# EAGLE design Interface (EAGLE 7.6.0)
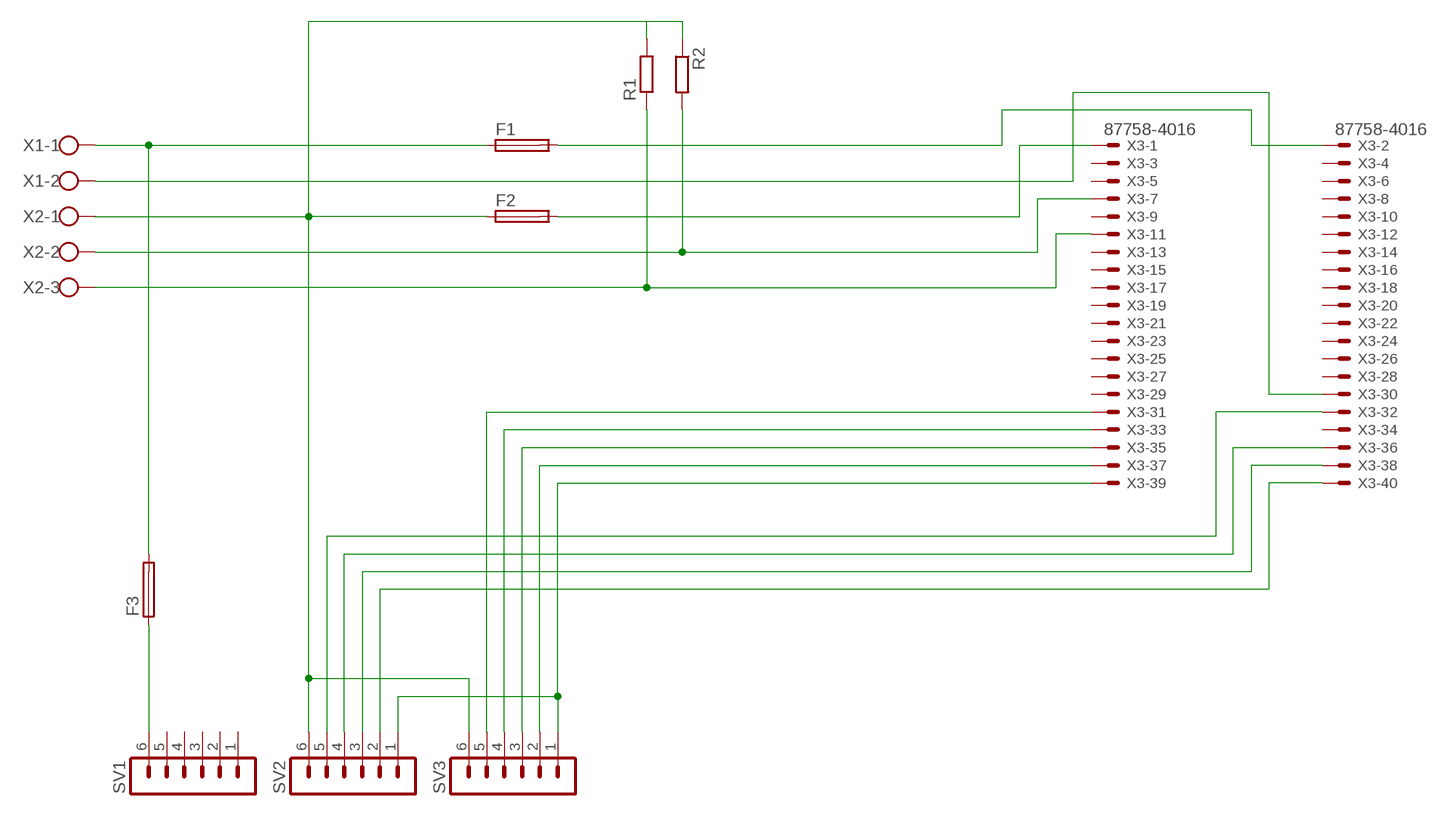
[diagram p0: schematic, sheet 1]

## Parts
F1  GSH15  [GSH15]
F2  GSH15  [GSH15]
F3  GSH15  [GSH15]
R1  R-EU_0207/10  [0207/10]
R2  R-EU_0207/5V  [0207/5V]
SV1  MA06-1  [MA06-1]
SV2  MA06-1  [MA06-1]
SV3  MA06-1  [MA06-1]
X1  W237-102  [W237-102]
X2  W237-103  [W237-103]
X3  87758-4016  [87758-4016]

## Nets
N$1: F1.1 F3.2 X1.1
N$2: F2.1 R1.2 R2.1 SV2.6 SV3.6 X2.1
N$3: F3.1 SV1.6
N$4: X1.2 X3.30
N$5: R2.2 X2.2 X3.7
N$6: R1.1 X2.3 X3.11
N$7: SV2.5 X3.32
N$8: SV2.4 X3.36
N$9: SV2.3 X3.38
N$10: SV2.2 X3.40
N$11: SV3.2 X3.37
N$12: SV3.3 X3.35
N$13: SV3.4 X3.33
N$14: SV3.5 X3.31
N$15: F2.2 X3.1
N$16: F1.2 X3.2
N$17: SV2.1 SV3.1 X3.39
Unconnected: SV1.1 SV1.2 SV1.3 SV1.4 SV1.5 X3.3 X3.4 X3.5 X3.6 X3.8 X3.9 X3.10 X3.12 X3.13 X3.14 X3.15 X3.16 X3.17 X3.18 X3.19 X3.20 X3.21 X3.22 X3.23 X3.24 X3.25 X3.26 X3.27 X3.28 X3.29 X3.34

## Library data of the parts
F1-F3 = fuse:GSH15: FUSE HOLDER grid 15mm, 19649 Wickmann; MPN: 64900001039; OC_FARNELL: 1271673; OC_NEWARK: 02P0318
R1 R2 = resistor:R-EU_: RESISTOR, European symbol
SV1-SV3 = con-lstb:MA06-1: PIN HEADER; OC_FARNELL: unknown; OC_NEWARK: unknown
X1 = con-wago-500:W237-102: WAGO SCREW CLAMP; MPN: 237-102; OC_FARNELL: unknown; OC_NEWARK: 70K9898
X2 = con-wago-500:W237-103: WAGO SCREW CLAMP; MPN: 237-103; OC_FARNELL: unknown; OC_NEWARK: 18M7116
X3 = con-molex:87758-4016: 40 Pin - 2mm Dual Row Single Wafer, Vertical T/H HDR Source: http://www.molex.com/pdm_docs/sd/877580616_sd.pdf; MPN: 87758-4016; OC_FARNELL: unknown; OC_NEWARK: 25M5691

## Board
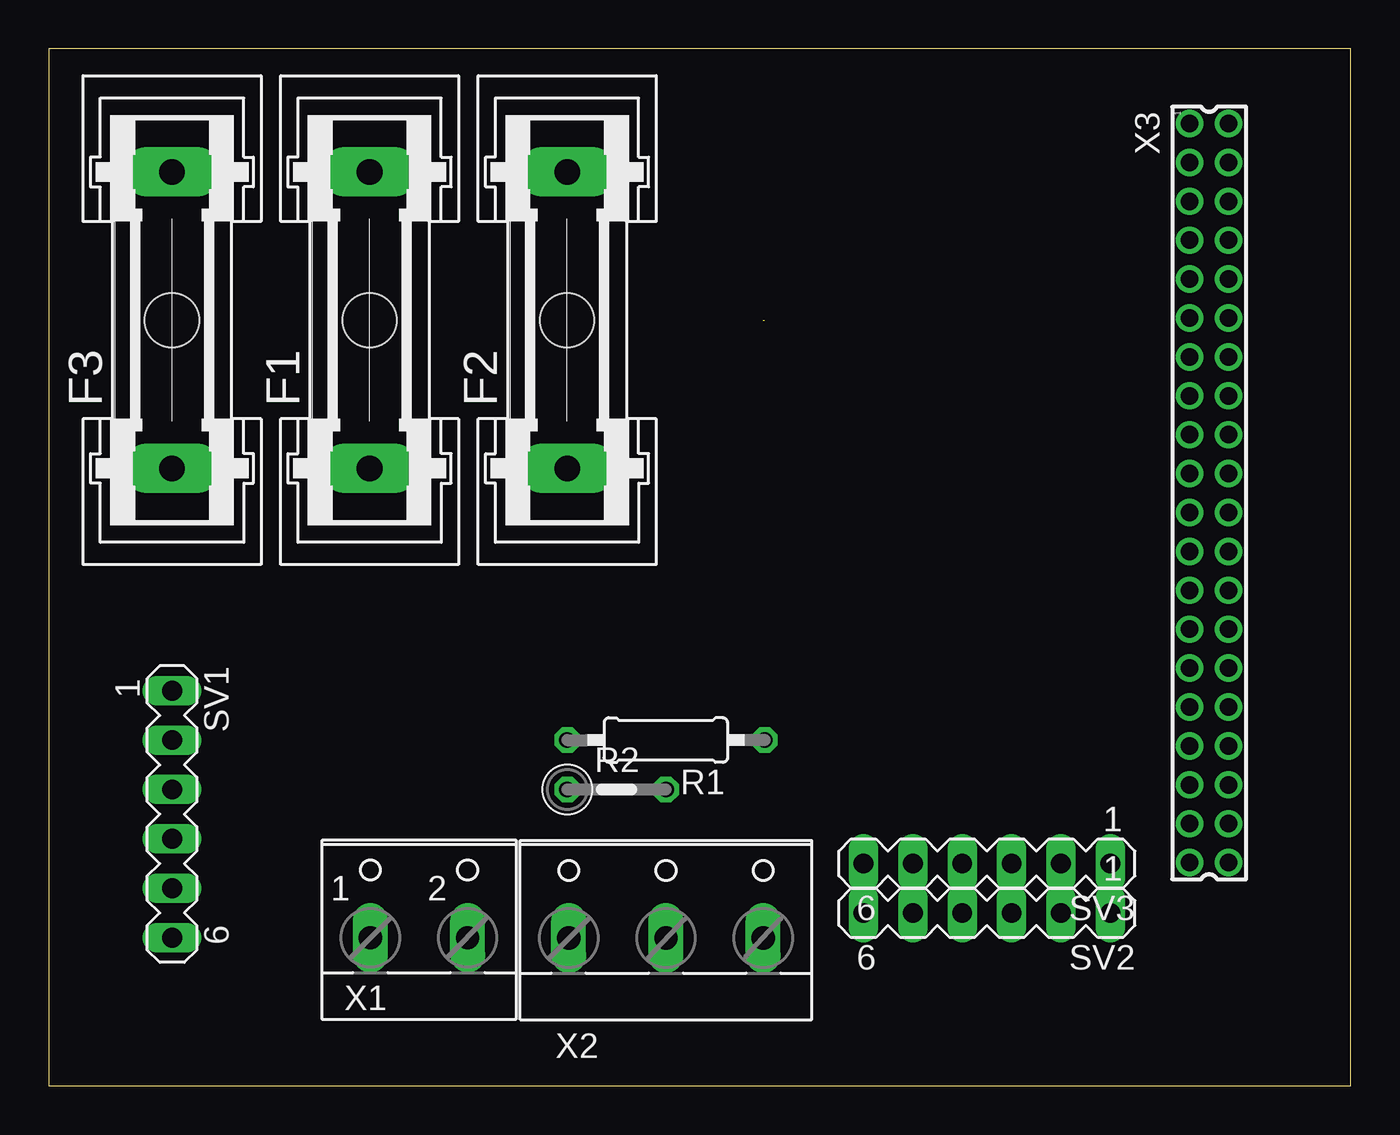
[diagram p1: board, top side]
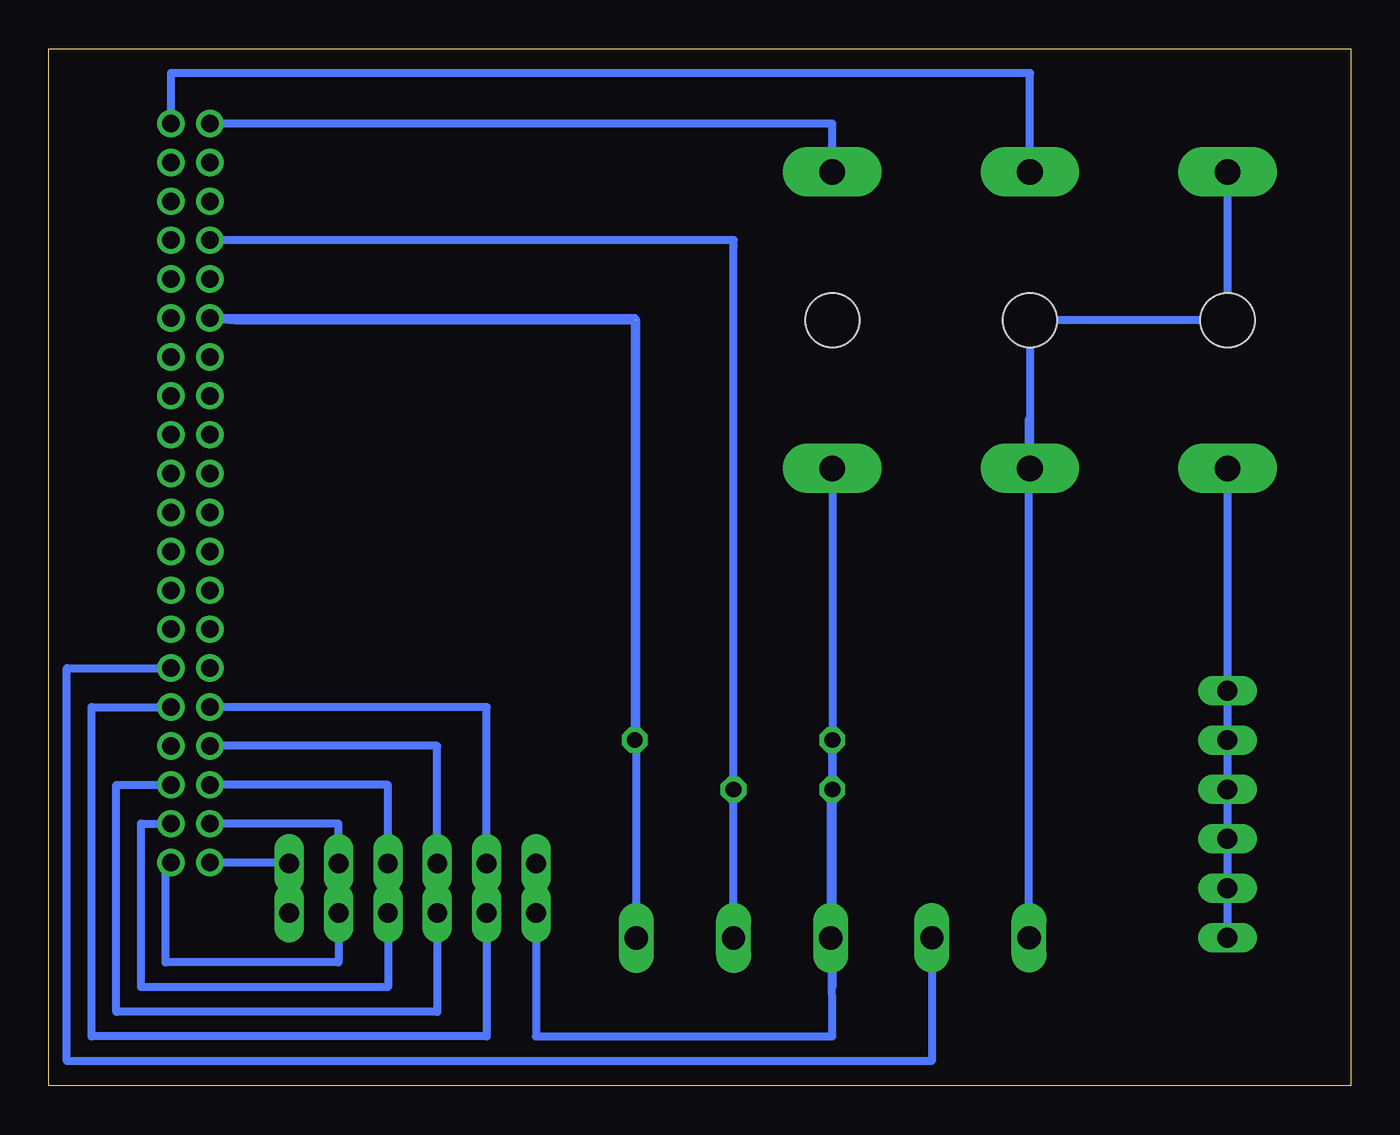
[diagram p2: board, bottom side, seen from below]

Size 66.98 x 53.33 mm. Coordinates in mm from the lower left corner, seen from the top.
Outline: 0,0 66.98,0 66.98,53.33 0,53.33 0,0
Copper layers (1*16): Top 0.035mm / dielectric 1.5mm / Bottom 0.035mm
Design rules "default": minimum track width 10mil, minimum drill 24mil, track to track 8mil, track to pad 8mil, pad to pad 8mil, via to via 8mil, smd to smd 8mil, copper to edge 40mil, drill to drill 8mil, minimum pad ring 10mil, minimum via ring 8mil, stop-mask expansion 4mil, vias tented up to drill 0mil, thermal gap 10mil

### Footprints (pad centres in the part's own frame; a part is rotated, then mirrored left to right if it is on the bottom)
GSH15 = drill 1.321 pad 2.54 long: 1 -7.62,0; 2 7.62,0 | hole 2.794: 0,0
0207/10 = drill 0.813 octagon: 1 -5.08,0; 2 5.08,0
0207/5V = drill 0.813 octagon: 1 -2.54,0; 2 2.54,0
MA06-1 = drill 1.016 long: 1 -6.35,0; 2 -3.81,0; 3 -1.27,0; 4 1.27,0; 5 3.81,0; 6 6.35,0
W237-102 = drill 1.194 long: 1 -2.5,-1.27; 2 2.5,-1.27
W237-103 = drill 1.194 long: 1 -5,-1.29; 2 0,-1.29; 3 5,-1.29
87758-4016 = drill 0.9 pad 1.27: 1 -19,-1; 2 -19,1; 3 -17,-1; 4 -17,1; 5 -15,-1; 6 -15,1; 7 -13,-1; 8 -13,1; 9 -11,-1; 10 -11,1; 11 -9,-1; 12 -9,1; 13 -7,-1; 14 -7,1; 15 -5,-1; 16 -5,1; 17 -3,-1; 18 -3,1; 19 -1,-1; 20 -1,1; 21 1,-1; 22 1,1; 23 3,-1; 24 3,1; 25 5,-1; 26 5,1; 27 7,-1; 28 7,1; 29 9,-1; 30 9,1; 31 11,-1; 32 11,1; 33 13,-1; 34 13,1; 35 15,-1; 36 15,1; 37 17,-1; 38 17,1; 39 19,-1; 40 19,1

### Placement (x,y rotation side)
F1  16.51,39.37 90 top
F2  26.67,39.37 90 top
F3  6.35,39.37 90 top
R1  31.75,17.78 180 top
R2  29.21,15.24 0 top
SV1  6.35,13.97 270 top
SV2  48.26,8.89 180 top
SV3  48.26,11.43 180 top
X1  19.05,8.89 0 top
X2  31.75,8.89 0 top
X3  59.69,30.48 270 top

### Tracks (layer width: path | path; a pad name or v marks a point on that pad's centre or on a via)
N$1
  Bottom 0.406: X1.1 16.55,34.29 F1.1 16.51,39.37 6.35,39.37 F3.2
N$2
  Bottom 0.406: 26.75,15.24 X2.1 26.67,5.06 R1.2 R2.1 | 26.75,15.24 R2.1 | 26.75,15.24 26.67,2.54 41.91,2.54 SV2.6 SV3.6 | F2.1 R2.1
N$3
  Bottom 0.406: F3.1 SV1.6
N$4
  Bottom 0.406: X1.2 21.55,1.27 66.04,1.27 66.04,21.48 X3.30
N$5
  Bottom 0.406: X2.2 R2.2 | R2.2 31.75,43.18 | 38.1,43.48 X3.7 31.75,43.48 R2.2
N$6  (1 unrouted)
  Bottom 0.406: X2.3 36.75,39.37 | 36.83,39.37 57.42,39.37 X3.11 36.83,39.48 R1.1
N$7
  Bottom 0.406: SV2.5 44.45,2.54 64.77,2.54 64.77,19.48 X3.32
N$8
  Bottom 0.406: SV2.4 46.99,3.81 63.5,3.81 63.5,15.48 X3.36
N$9
  Bottom 0.406: SV2.3 49.53,5.08 62.23,5.08 62.23,13.48 X3.38
N$10
  Bottom 0.406: SV2.2 52.07,6.35 60.96,6.35 60.96,11.48 X3.40
N$11
  Bottom 0.406: SV3.2 52.07,13.48 X3.37
N$12
  Bottom 0.406: SV3.3 49.53,15.48 X3.35
N$13
  Bottom 0.406: SV3.4 46.99,17.48 X3.33
N$14
  Bottom 0.406: SV3.5 44.45,19.48 X3.31
N$15
  Bottom 0.406: F2.2 26.67,49.48 X3.1
N$16
  Bottom 0.406: F1.2 16.51,52.07 60.69,52.07 X3.2
N$17
  Bottom 0.406: SV2.1 SV3.1 54.61,11.48 X3.39